# EasyEDA schematic test.json
TITLE: Sheet_1; REV: 1.0; Date: 2020-07-05; Sheet: 1/1; Drawn By: patrick910826; Company: Your Company
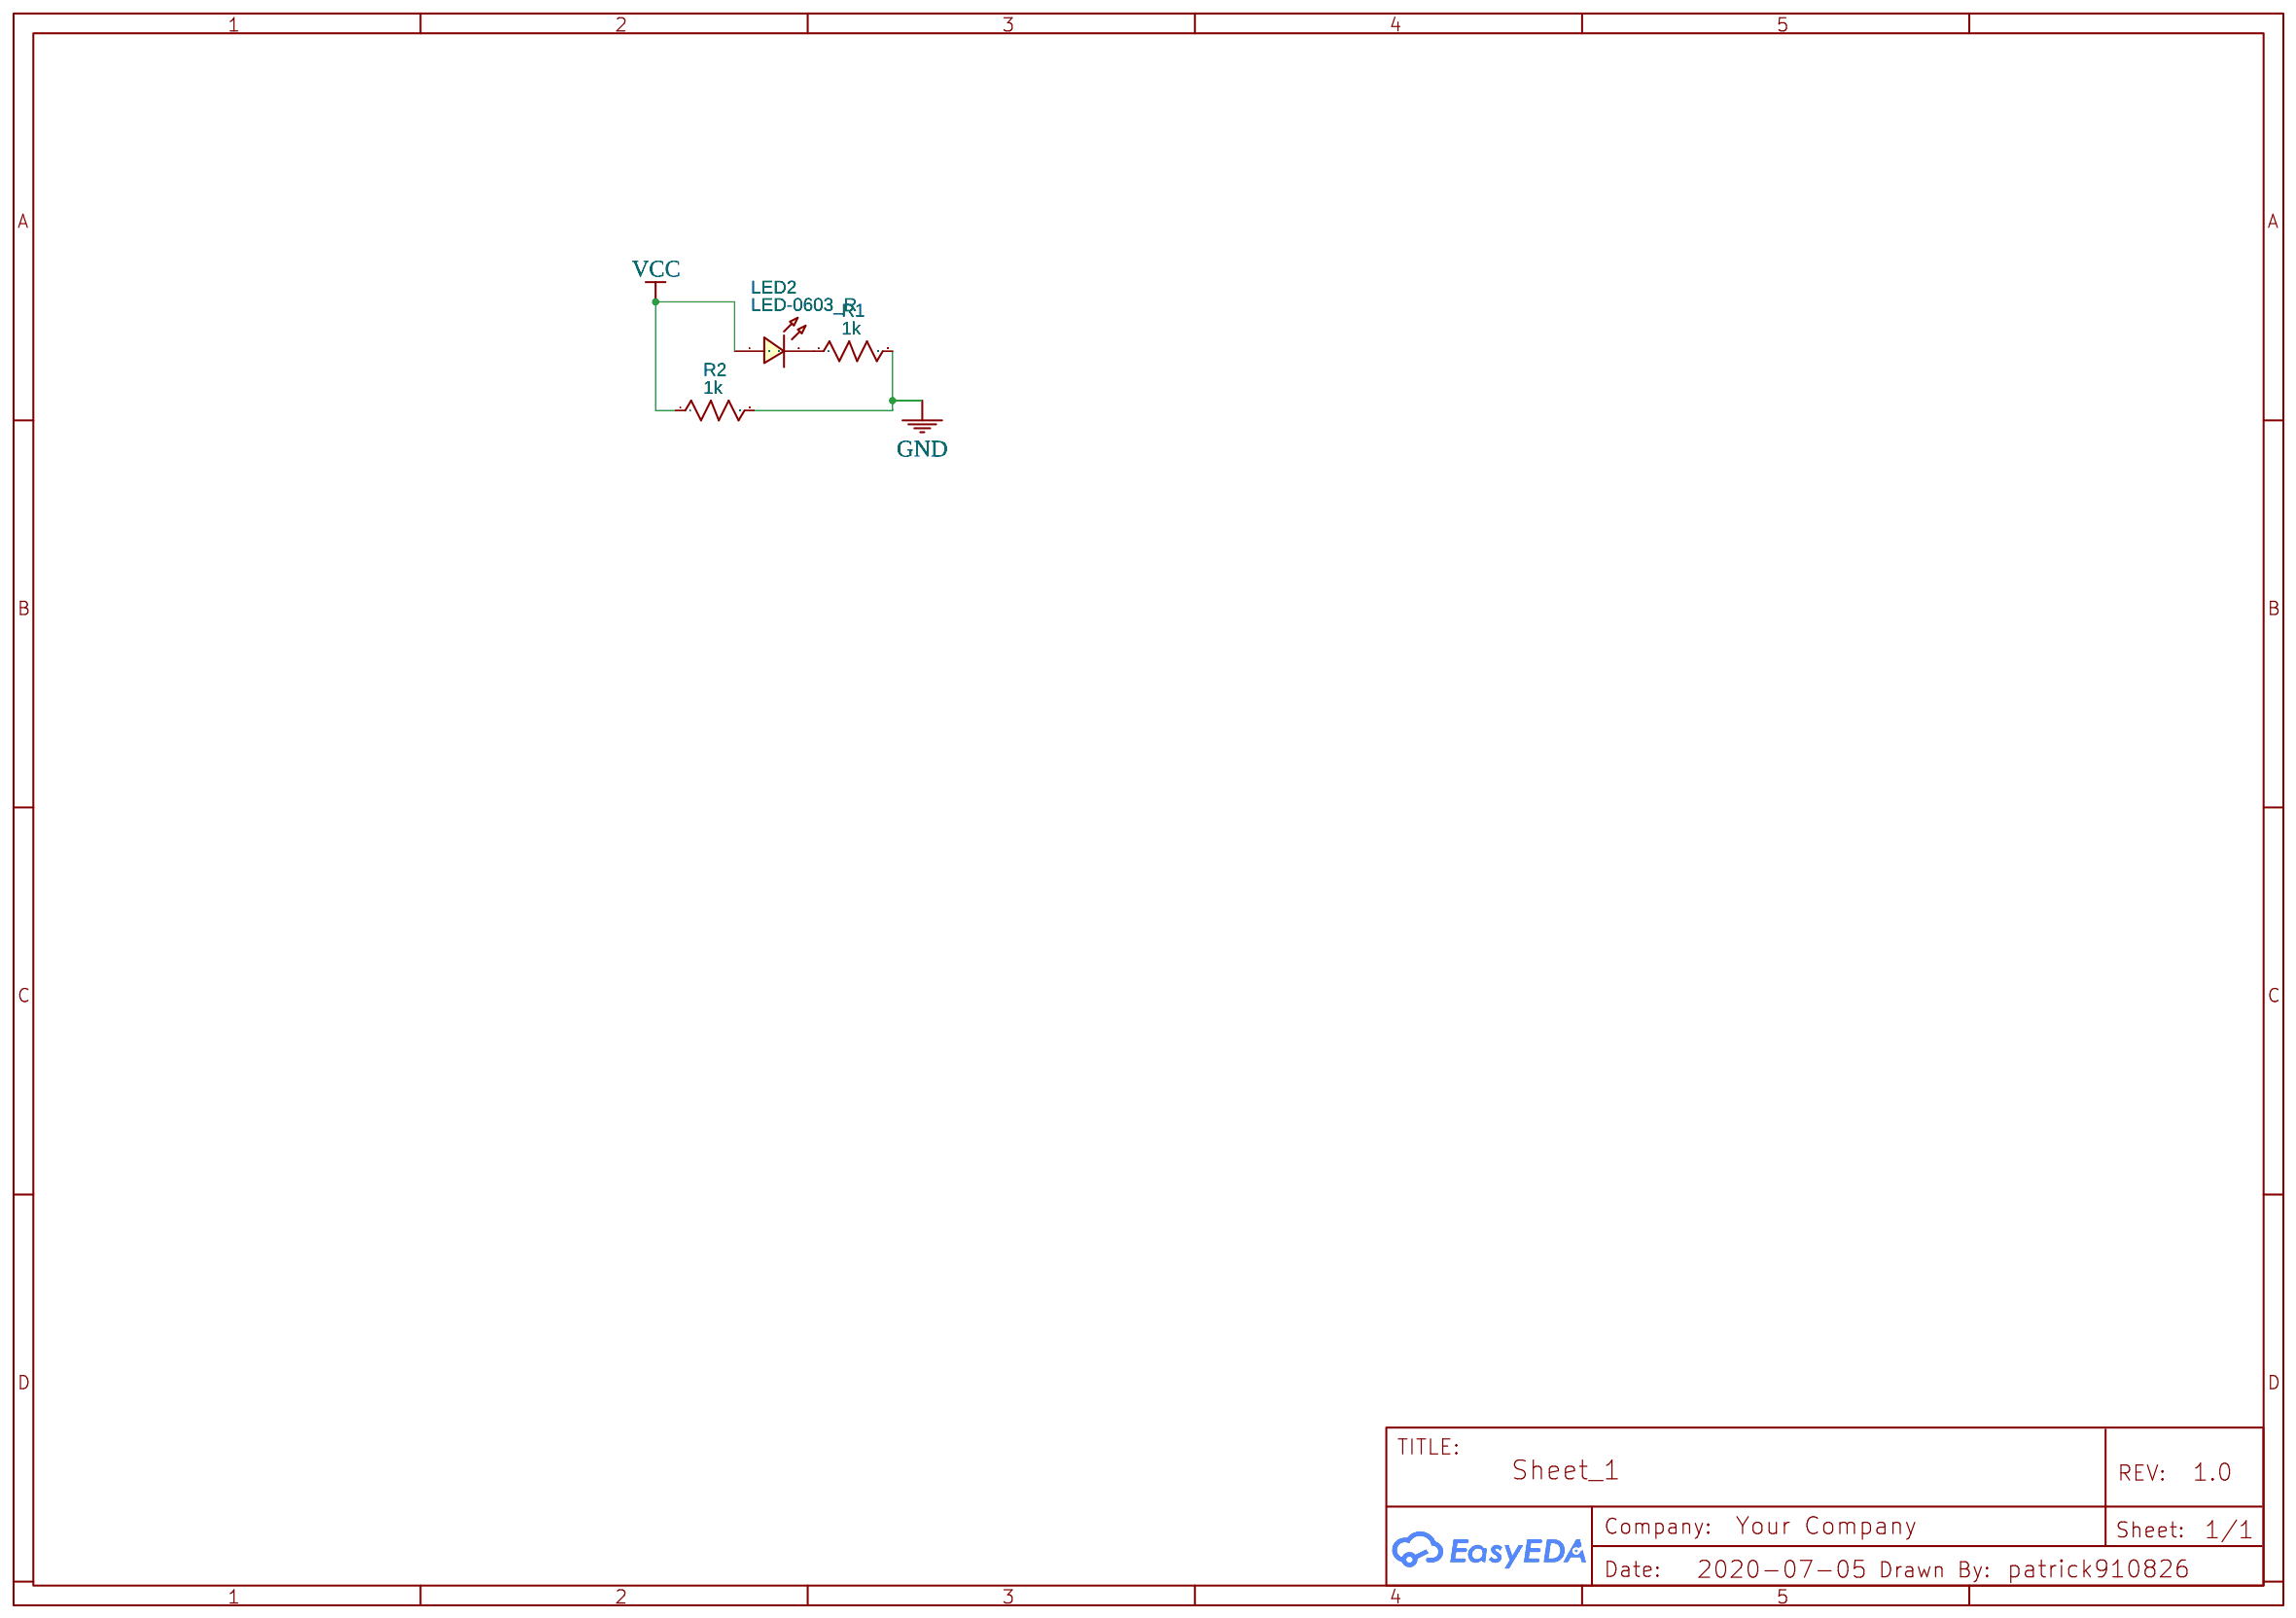
[diagram p0: schematic sheet]

## Parts
LED2  LED-0603_R  [LED0603_RED]
R1  1k  [R_AXIAL-0.5]
R2  1k  [R_AXIAL-0.5]

## Library data of the parts
LED2 = LED-0603_R: Manufacturer: EVERLIGHT(台湾亿光); Manufacturer Part: 19-217/R6C-AL1M2VY/3T; Supplier Part: C72044; Supplier: LCSC; Contributor: LCEDA_01
R1 R2 = R_AXIAL-0.5_US: Contributor: LCEDA_Lib

## Nets
GND: R1.2 R2.2
VCC: LED2.1 R2.1
Net-(LED2-2): LED2.2 R1.1
